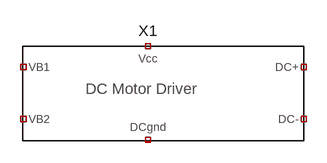
[diagram p0: schematic EXP3A Simulation the Motor Driver Circuit.asc]
EXP3A Simulation the Motor Driver Circuit.asc, the LTspice schematic file:
Version 4
SHEET 1 1376 684
SYMBOL DC_Motor_Driver 96 224 R0
SYMATTR InstName X1

The netlist it stands for:
* EXP3A Simulation the Motor Driver Circuit.asc
XX1 NC_01 NC_02 NC_03 NC_04 NC_05 NC_06 DC_Motor_Driver  ; pins VB1 VB2 DC+ DC- DCgnd Vcc
.backanno
.end